# Altium schematic sheet QCopterMV_FSMC_Sch.SchDoc
size A4; DocumentNumber: 10; SheetNumber: 10; SheetTotal: 10
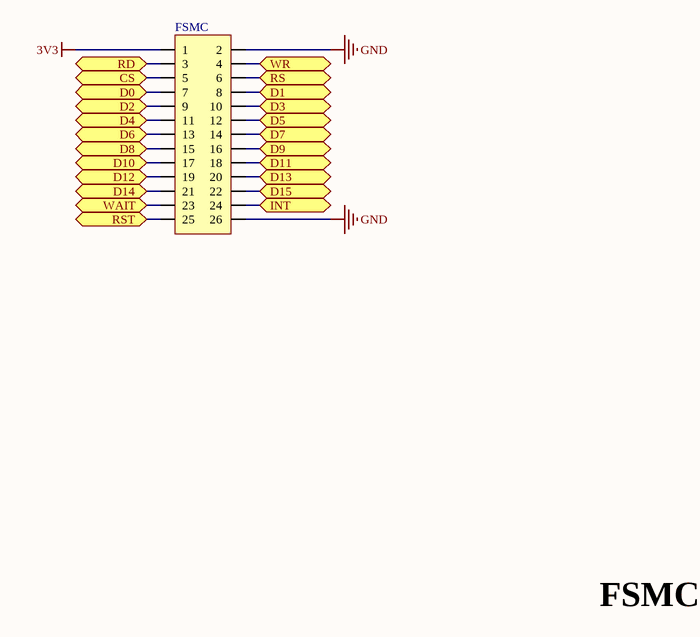
[diagram p0: QCopterMV_FSMC_Sch.SchDoc]

## Parts
FSMC  HDR2X13_180FTB_2.54  [HDR2X13_180FTB_2.54]  (value not drawn)

## Ports
CS, D0, D1, D2, D3, D4, D5, D6, D7, D8, D9, D10, D11, D12, D13, D14, D15, INT, RD, RS, RST, WAIT, WR

## Nets
3V3: FSMC.1
GND: FSMC.2 FSMC.26
CS: FSMC.5 ; port CS
D0: FSMC.7 ; port D0
D1: FSMC.8 ; port D1
D2: FSMC.9 ; port D2
D3: FSMC.10 ; port D3
D4: FSMC.11 ; port D4
D5: FSMC.12 ; port D5
D6: FSMC.13 ; port D6
D7: FSMC.14 ; port D7
D8: FSMC.15 ; port D8
D9: FSMC.16 ; port D9
D10: FSMC.17 ; port D10
D11: FSMC.18 ; port D11
D12: FSMC.19 ; port D12
D13: FSMC.20 ; port D13
D14: FSMC.21 ; port D14
D15: FSMC.22 ; port D15
INT: FSMC.24 ; port INT
RD: FSMC.3 ; port RD
RS: FSMC.6 ; port RS
RST: FSMC.25 ; port RST
WAIT: FSMC.23 ; port WAIT
WR: FSMC.4 ; port WR

## Notes on the sheet
- FSMC

## Library data of the parts
FSMC = HDR2X13_180FTB_2.54: Header